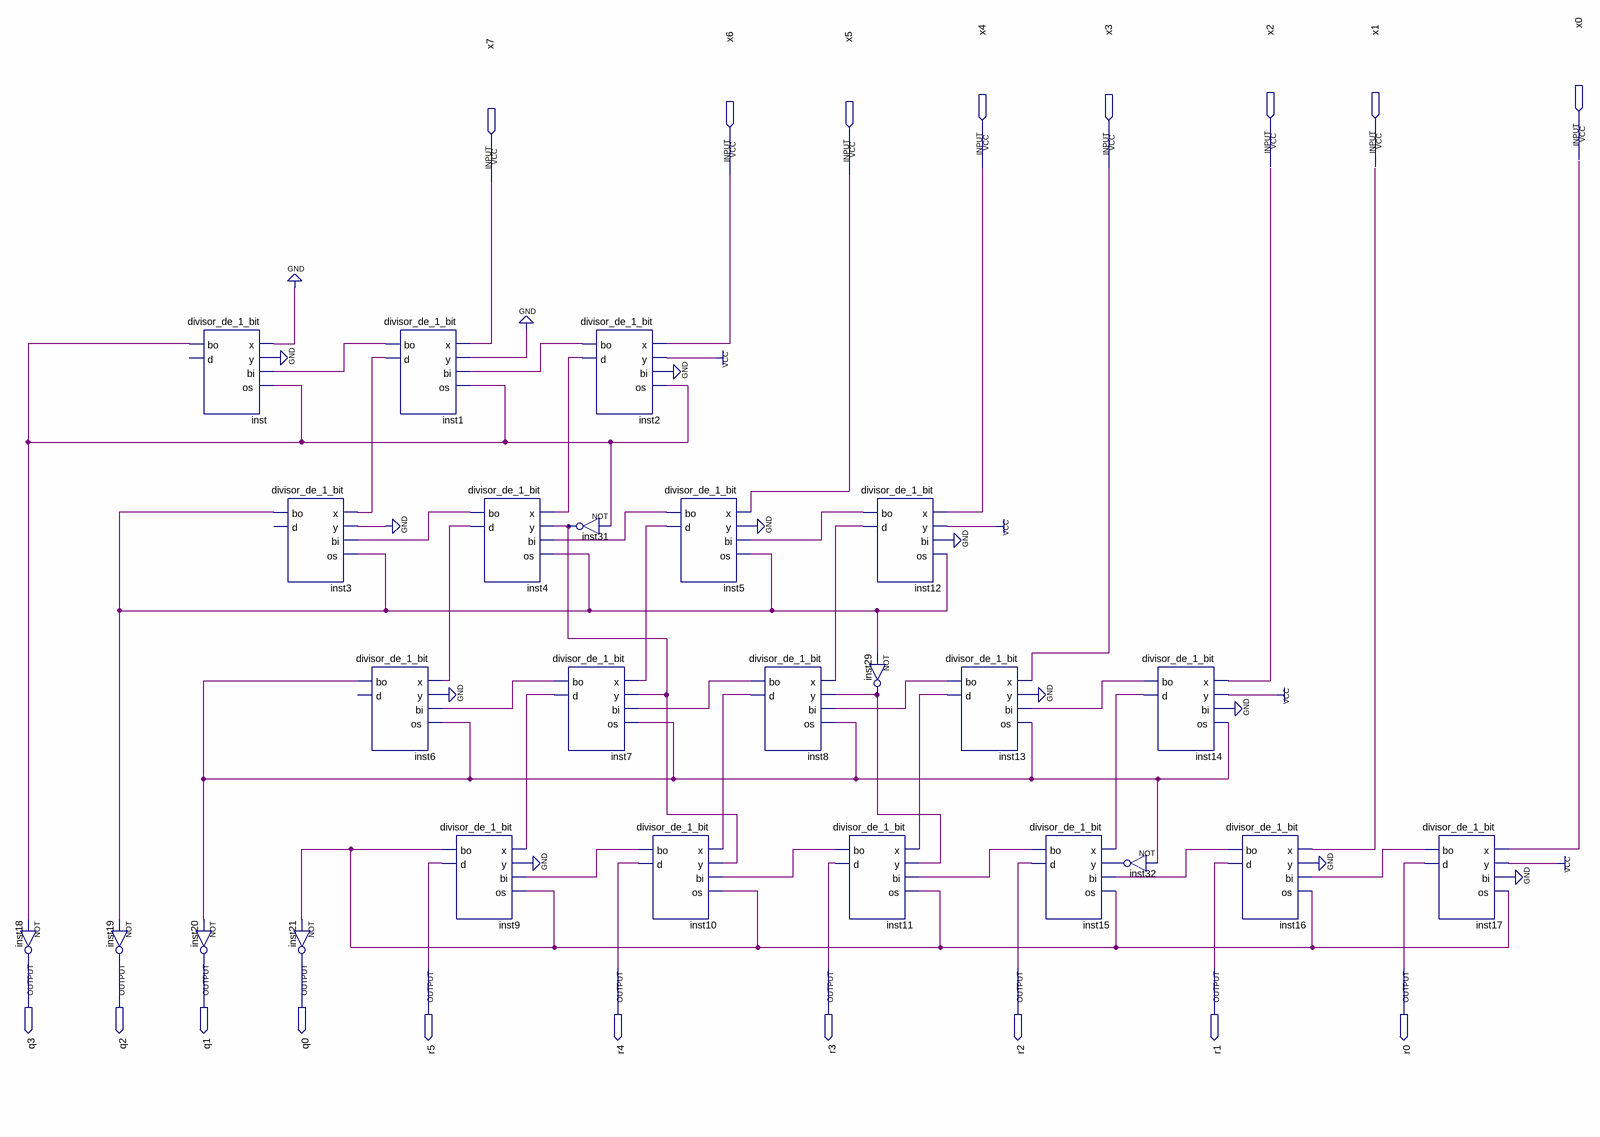
[diagram p0: schematic sheet]
// Quartus schematic raiz.bdf as structural Verilog: 25 symbols, 18 pins
module raiz (
  input  x0,
  input  x4,
  input  x3,
  input  x2,
  input  x1,
  input  x6,
  input  x5,
  input  x7,
  output q3,
  output q2,
  output q1,
  output q0,
  output r5,
  output r4,
  output r3,
  output r2,
  output r1,
  output r0
);

  wire inst1_bo, inst1_d, inst2_bo, inst2_d, inst3_bo, inst4_bo, inst4_d, inst5_bo, inst5_d, inst6_bo,
       inst7_bo, inst7_d, inst8_bo, inst8_d, inst9_bo, inst10_bo, inst11_bo, inst12_bo, inst12_d, inst13_bo,
       inst13_d, inst14_bo, inst14_d, inst15_bo, inst16_bo, inst17_bo, inst29_out, inst31_out, inst32_out,
       inst_bo;

  not inst18 (q3, inst_bo);
  not inst19 (q2, inst3_bo);
  divisor_de_1_bit inst (.x(1'b0), .y(1'b0), .bi(inst1_bo), .os(inst_bo), .bo(inst_bo));  // open: d
  not inst20 (q1, inst6_bo);
  divisor_de_1_bit inst3 (.x(inst1_d), .y(1'b0), .bi(inst4_bo), .os(inst3_bo), .bo(inst3_bo));  // open: d
  not inst21 (q0, inst9_bo);
  divisor_de_1_bit inst1 (.x(x7), .y(1'b0), .bi(inst2_bo), .os(inst_bo), .bo(inst1_bo), .d(inst1_d));
  divisor_de_1_bit inst6 (.x(inst4_d), .y(1'b0), .bi(inst7_bo), .os(inst6_bo), .bo(inst6_bo));  // open: d
  divisor_de_1_bit inst9 (.x(inst7_d), .y(1'b0), .bi(inst10_bo), .os(inst9_bo), .bo(inst9_bo), .d(r5));
  divisor_de_1_bit inst4 (.x(inst2_d), .y(inst31_out), .bi(inst5_bo), .os(inst3_bo), .bo(inst4_bo), .d(inst4_d));
  divisor_de_1_bit inst7 (.x(inst5_d), .y(inst31_out), .bi(inst8_bo), .os(inst6_bo), .bo(inst7_bo), .d(inst7_d));
  divisor_de_1_bit inst2 (.x(x6), .y(1'b1), .bi(1'b0), .os(inst_bo), .bo(inst2_bo), .d(inst2_d));
  not inst31 (inst31_out, inst_bo);
  divisor_de_1_bit inst5 (.x(x5), .y(1'b0), .bi(inst12_bo), .os(inst3_bo), .bo(inst5_bo), .d(inst5_d));
  divisor_de_1_bit inst10 (.x(inst8_d), .y(inst31_out), .bi(inst11_bo), .os(inst9_bo), .bo(inst10_bo), .d(r4));
  divisor_de_1_bit inst8 (.x(inst12_d), .y(inst29_out), .bi(inst13_bo), .os(inst6_bo), .bo(inst8_bo), .d(inst8_d));
  divisor_de_1_bit inst11 (.x(inst13_d), .y(inst29_out), .bi(inst15_bo), .os(inst9_bo), .bo(inst11_bo), .d(r3));
  divisor_de_1_bit inst12 (.x(x4), .y(1'b1), .bi(1'b0), .os(inst3_bo), .bo(inst12_bo), .d(inst12_d));
  not inst29 (inst29_out, inst3_bo);
  divisor_de_1_bit inst13 (.x(x3), .y(1'b0), .bi(inst14_bo), .os(inst6_bo), .bo(inst13_bo), .d(inst13_d));
  divisor_de_1_bit inst15 (.x(inst14_d), .y(inst32_out), .bi(inst16_bo), .os(inst9_bo), .bo(inst15_bo), .d(r2));
  not inst32 (inst32_out, inst6_bo);
  divisor_de_1_bit inst14 (.x(x2), .y(1'b1), .bi(1'b0), .os(inst6_bo), .bo(inst14_bo), .d(inst14_d));
  divisor_de_1_bit inst16 (.x(x1), .y(1'b0), .bi(inst17_bo), .os(inst9_bo), .bo(inst16_bo), .d(r1));
  divisor_de_1_bit inst17 (.x(x0), .y(1'b1), .bi(1'b0), .os(inst9_bo), .bo(inst17_bo), .d(r0));
endmodule
